# Altium schematic sheet [07] - PERIPHERALS B.SchDoc: Test title
size A4; Date: YYYY-MM-DD; Engineer: X; SheetNumber: 7; Size: A4
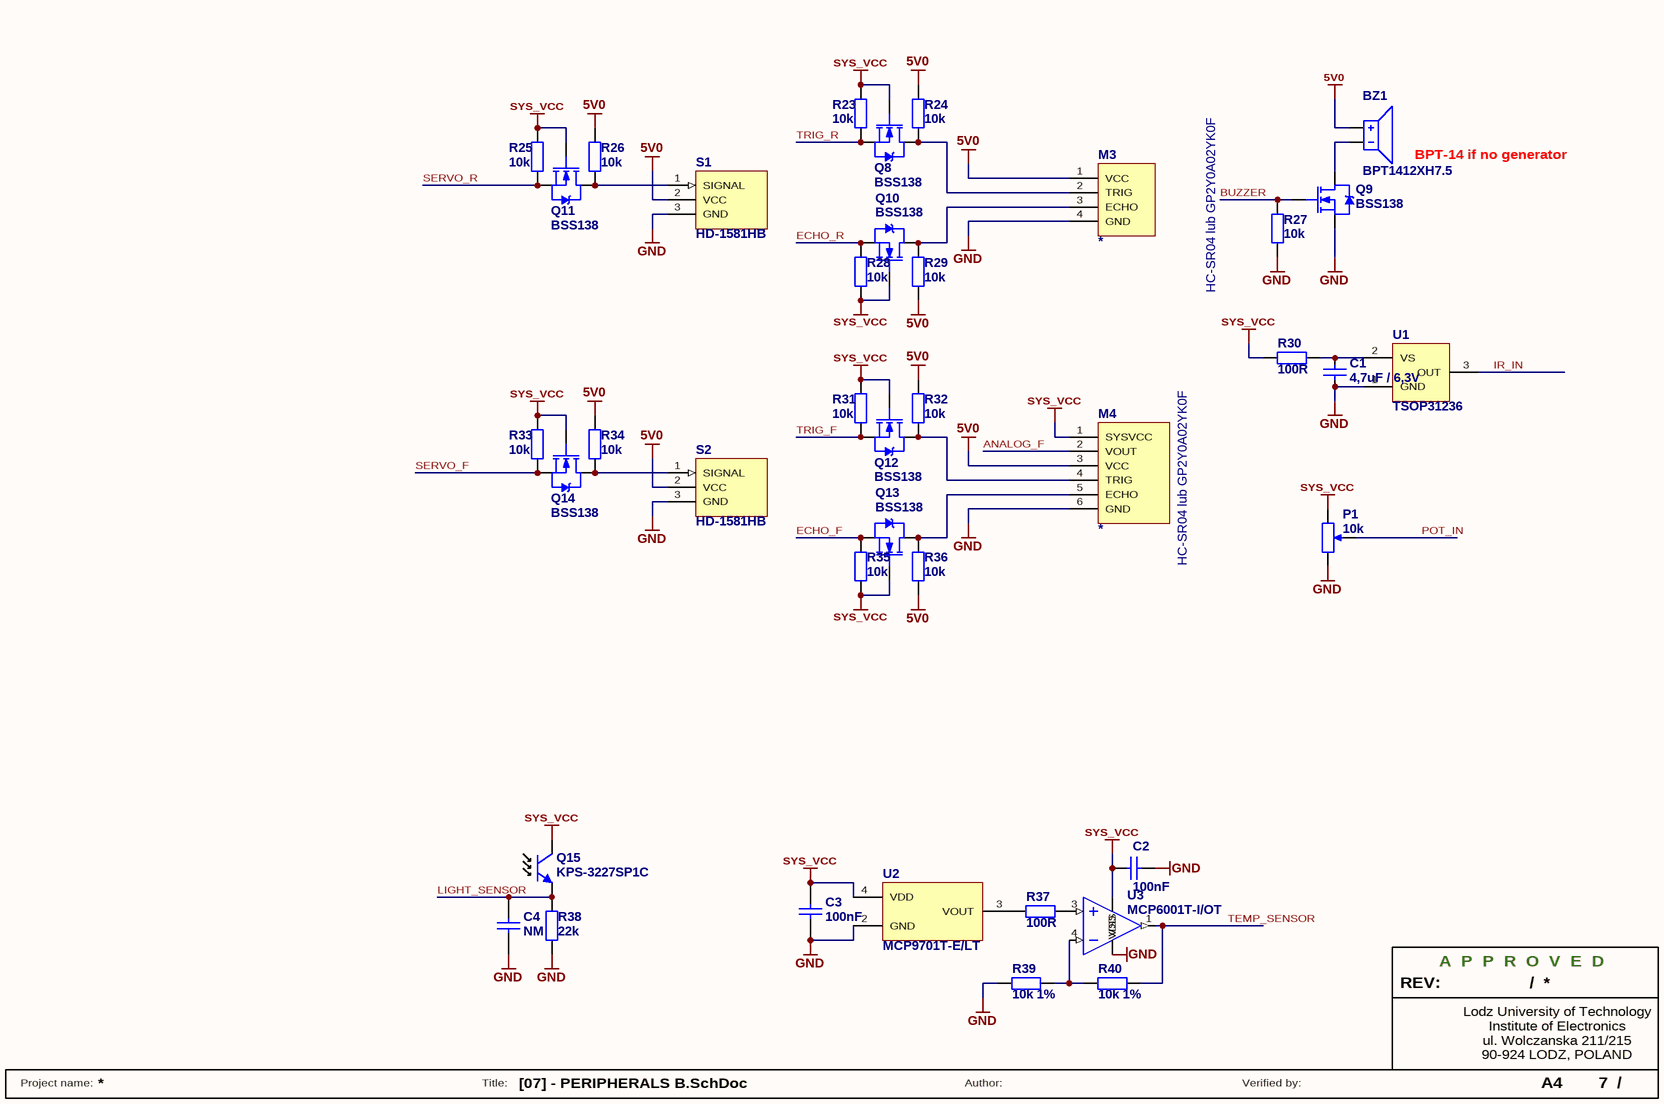
[diagram p0: [07] - PERIPHERALS B.SchDoc]

## Parts
BZ1  BPT1412XH7.5  [BUZ-13,8-7,6]
C1  4,7uF / 6,3V  [C0805]
C2  100nF  [C0805]
C3  100nF  [C0805]
C4  NM  [C0805]
M3  *  [HC-SR04]
M4  *  [HC-SR04_UNIV]
P1  10k  [RK09K113004U]
Q8  BSS138  [SOT-23]
Q9  BSS138  [SOT-23]
Q10  BSS138  [SOT-23]
Q11  BSS138  [SOT-23]
Q12  BSS138  [SOT-23]
Q13  BSS138  [SOT-23]
Q14  BSS138  [SOT-23]
Q15  KPS-3227SP1C  [KPS-3227]
R23  10k  [R0805]
R24  10k  [R0805]
R25  10k  [R0805]
R26  10k  [R0805]
R27  10k  [R0805]
R28  10k  [R0805]
R29  10k  [R0805]
R30  100R  [R0805]
R31  10k  [R0805]
R32  10k  [R0805]
R33  10k  [R0805]
R34  10k  [R0805]
R35  10k  [R0805]
R36  10k  [R0805]
R37  100R  [R0805]
R38  22k  [R0805]
R39  10k 1%  [R0805]
R40  10k 1%  [R0805]
S1  HD-1581HB  [HD-1581HB_VERTICAL_1]
S2  HD-1581HB  [HD-1581HB_VERTICAL_1]
U1  TSOP31236  [TSOP312(4)_H]
U2  MCP9701T-E/LT  [SOT-323-5 (SOT-353, SC70-5)]
U3  MCP6001T-I/OT  [SOT-23-5]

## Nets
5V0: BZ1.1 M3.1(VCC) M4.3(VCC) R24.2 R26.2 R29.2 R32.2 R34.2 R36.2 S1.2(VCC) S2.2(VCC)
GND: C1.1 C2.2 C3.1 C4.1 M3.4(GND) M4.6(GND) P1.3(BOT) Q9.2(S) R27.2 R38.2 R39.2 S1.3(GND) S2.3(GND) U1.1(GND) U2.2(GND) U3.2(VSS)
SYS_VCC: C2.1 C3.2 M4.1(SYSVCC) P1.1(TOP) Q8.1(G) Q10.1(G) Q11.1(G) Q12.1(G) Q13.1(G) Q14.1(G) Q15.2(C) R23.2 R25.2 R28.2 R30.1 R31.2 R33.2 R35.2 U2.4(VDD) U3.5(VDD)
ANALOG_F: M4.2(VOUT)
BUZZER: Q9.1(G) R27.1
ECHO_F: Q13.2(S) R35.1
ECHO_R: Q10.2(S) R28.1
IR_IN: U1.3(OUT)
LIGHT_SENSOR: C4.2 Q15.1(E) R38.1
POT_IN: P1.2(TAP)
SERVO_F: Q14.2(S) R33.1
SERVO_R: Q11.2(S) R25.1
TEMP_SENSOR: R40.1 U3.1(OUT)
TRIG_F: Q12.2(S) R31.1
TRIG_R: Q8.2(S) R23.1
NetBZ1_2: BZ1.2 Q9.3(D)
NetC1_2: C1.2 R30.2 U1.2(VS)
NetM3_2: M3.2(TRIG) Q8.3(D) R24.1
NetM3_3: M3.3(ECHO) Q10.3(D) R29.1
NetM4_4: M4.4(TRIG) Q12.3(D) R32.1
NetM4_5: M4.5(ECHO) Q13.3(D) R36.1
NetQ11_3: Q11.3(D) R26.1 S1.1(SIGNAL)
NetQ14_3: Q14.3(D) R34.1 S2.1(SIGNAL)
NetR37_1: R37.1 U3.3(IN+)
NetR37_2: R37.2 U2.3(VOUT)
NetR39_1: R39.1 R40.2 U3.4(IN-)

## Notes on the sheet
- (near BZ1) BPT-14 if no generator
- HC-SR04 lub GP2Y0A02YK0F
- REV:
- A  P  P  R  O  V  E  D
- /
- Lodz University of Technology
- ul. Wolczanska 211/215
- 90-924 LODZ, POLAND
- Institute of Electronics
- Project name:
- Title:
- Author:
- Verified by:

## Library data of the parts
BZ1 = BPT1412XH7.5: Piezoelectric Sound Transducer: 5Vp-p; 4kHz; O:14mm; with generator; Published: 24-Mar-1999; Revision: July-2002: Re-released for DXP Platform.; Publisher: Altium Limited
C1-C4 = Cap: Capacitor; ComponentLink1Description: datasheet; ComponentLink2Description: supplier
  C1: Value: 4,7uF / 6,3V
  C2 C3: Value: 100nF
  C4: Value: NM
M3 = HC-SR04
M4 = HC-SR04_UNIVERSAL
P1 = RK09K113004U: Published: 21-10-2009; ComponentLink1Description: datasheet; ComponentLink2Description: supplier; Value: 10k
Q8-Q14 = BSS138: N-Channel Enhancement Mode Vertical DMOS FET; Published: 17-Dec-2003; DatasheetVersion: Mar-96; PackageVersion: 1996; PackageReference: SOT23; Publisher: Altium Limited; PackageDescription: SOT-23; 3 Leads; Body 3.1 x 2.5 mm, inc. leads (LxW max), Alternate Lead Configuration; ComponentLink1Description: Manufacturer Link; ComponentLink1URL: http://www.zetex.com/; ComponentLink2Description: Datasheet; ComponentLink2URL: www.zetex.com/3.0/pdf/BSS138.pdf
Q15 = KPS-3227SP1C: Photo Transistor 60V 0,1mA 580nm (TME KPS-3227SP1C); Supplier 1: TME; Supplier Part Number 1: ELPT15-21C
R23-R40 = Res: Resistor; Published: 19-Feb-2006; ComponentLink1Description: datasheet; ComponentLink2Description: supplier
  R23-R29 R31-R36: Value: 10k
  R30 R37: Value: 100R
  R38: Value: 22k
  R39 R40: Value: 10k 1%
S1 S2 = HD-1581HB: HD-1581HB Micro Servo
U1 = TSOP31236: 36kHz IR Receiver Module for Remote Control Systems
U2 = MCP9701T-E/LT: Low-Power Linear Active Thermistor IC
U3 = MCP6001T-I/OT: Rail-to-rail, 1MHz, 100uA Op Amp; Supplier 1: Farnell; Supplier 2: Farnell; Supplier 3: Farnell; Supplier 4: TME; Supplier 5: TME; Supplier 6: Farnell; Supplier Part Number 1: 4974992; Supplier Part Number 2: 2412853; Supplier Part Number 3: 4974992RL; Supplier Part Number 4: TS912ID; Supplier Part Number 5: MCP6001T-I/OT; Supplier Part Number 6: 1094386